# EAGLE schematic Centerboard - Prototype 2_WIP (EAGLE 7.2.0)
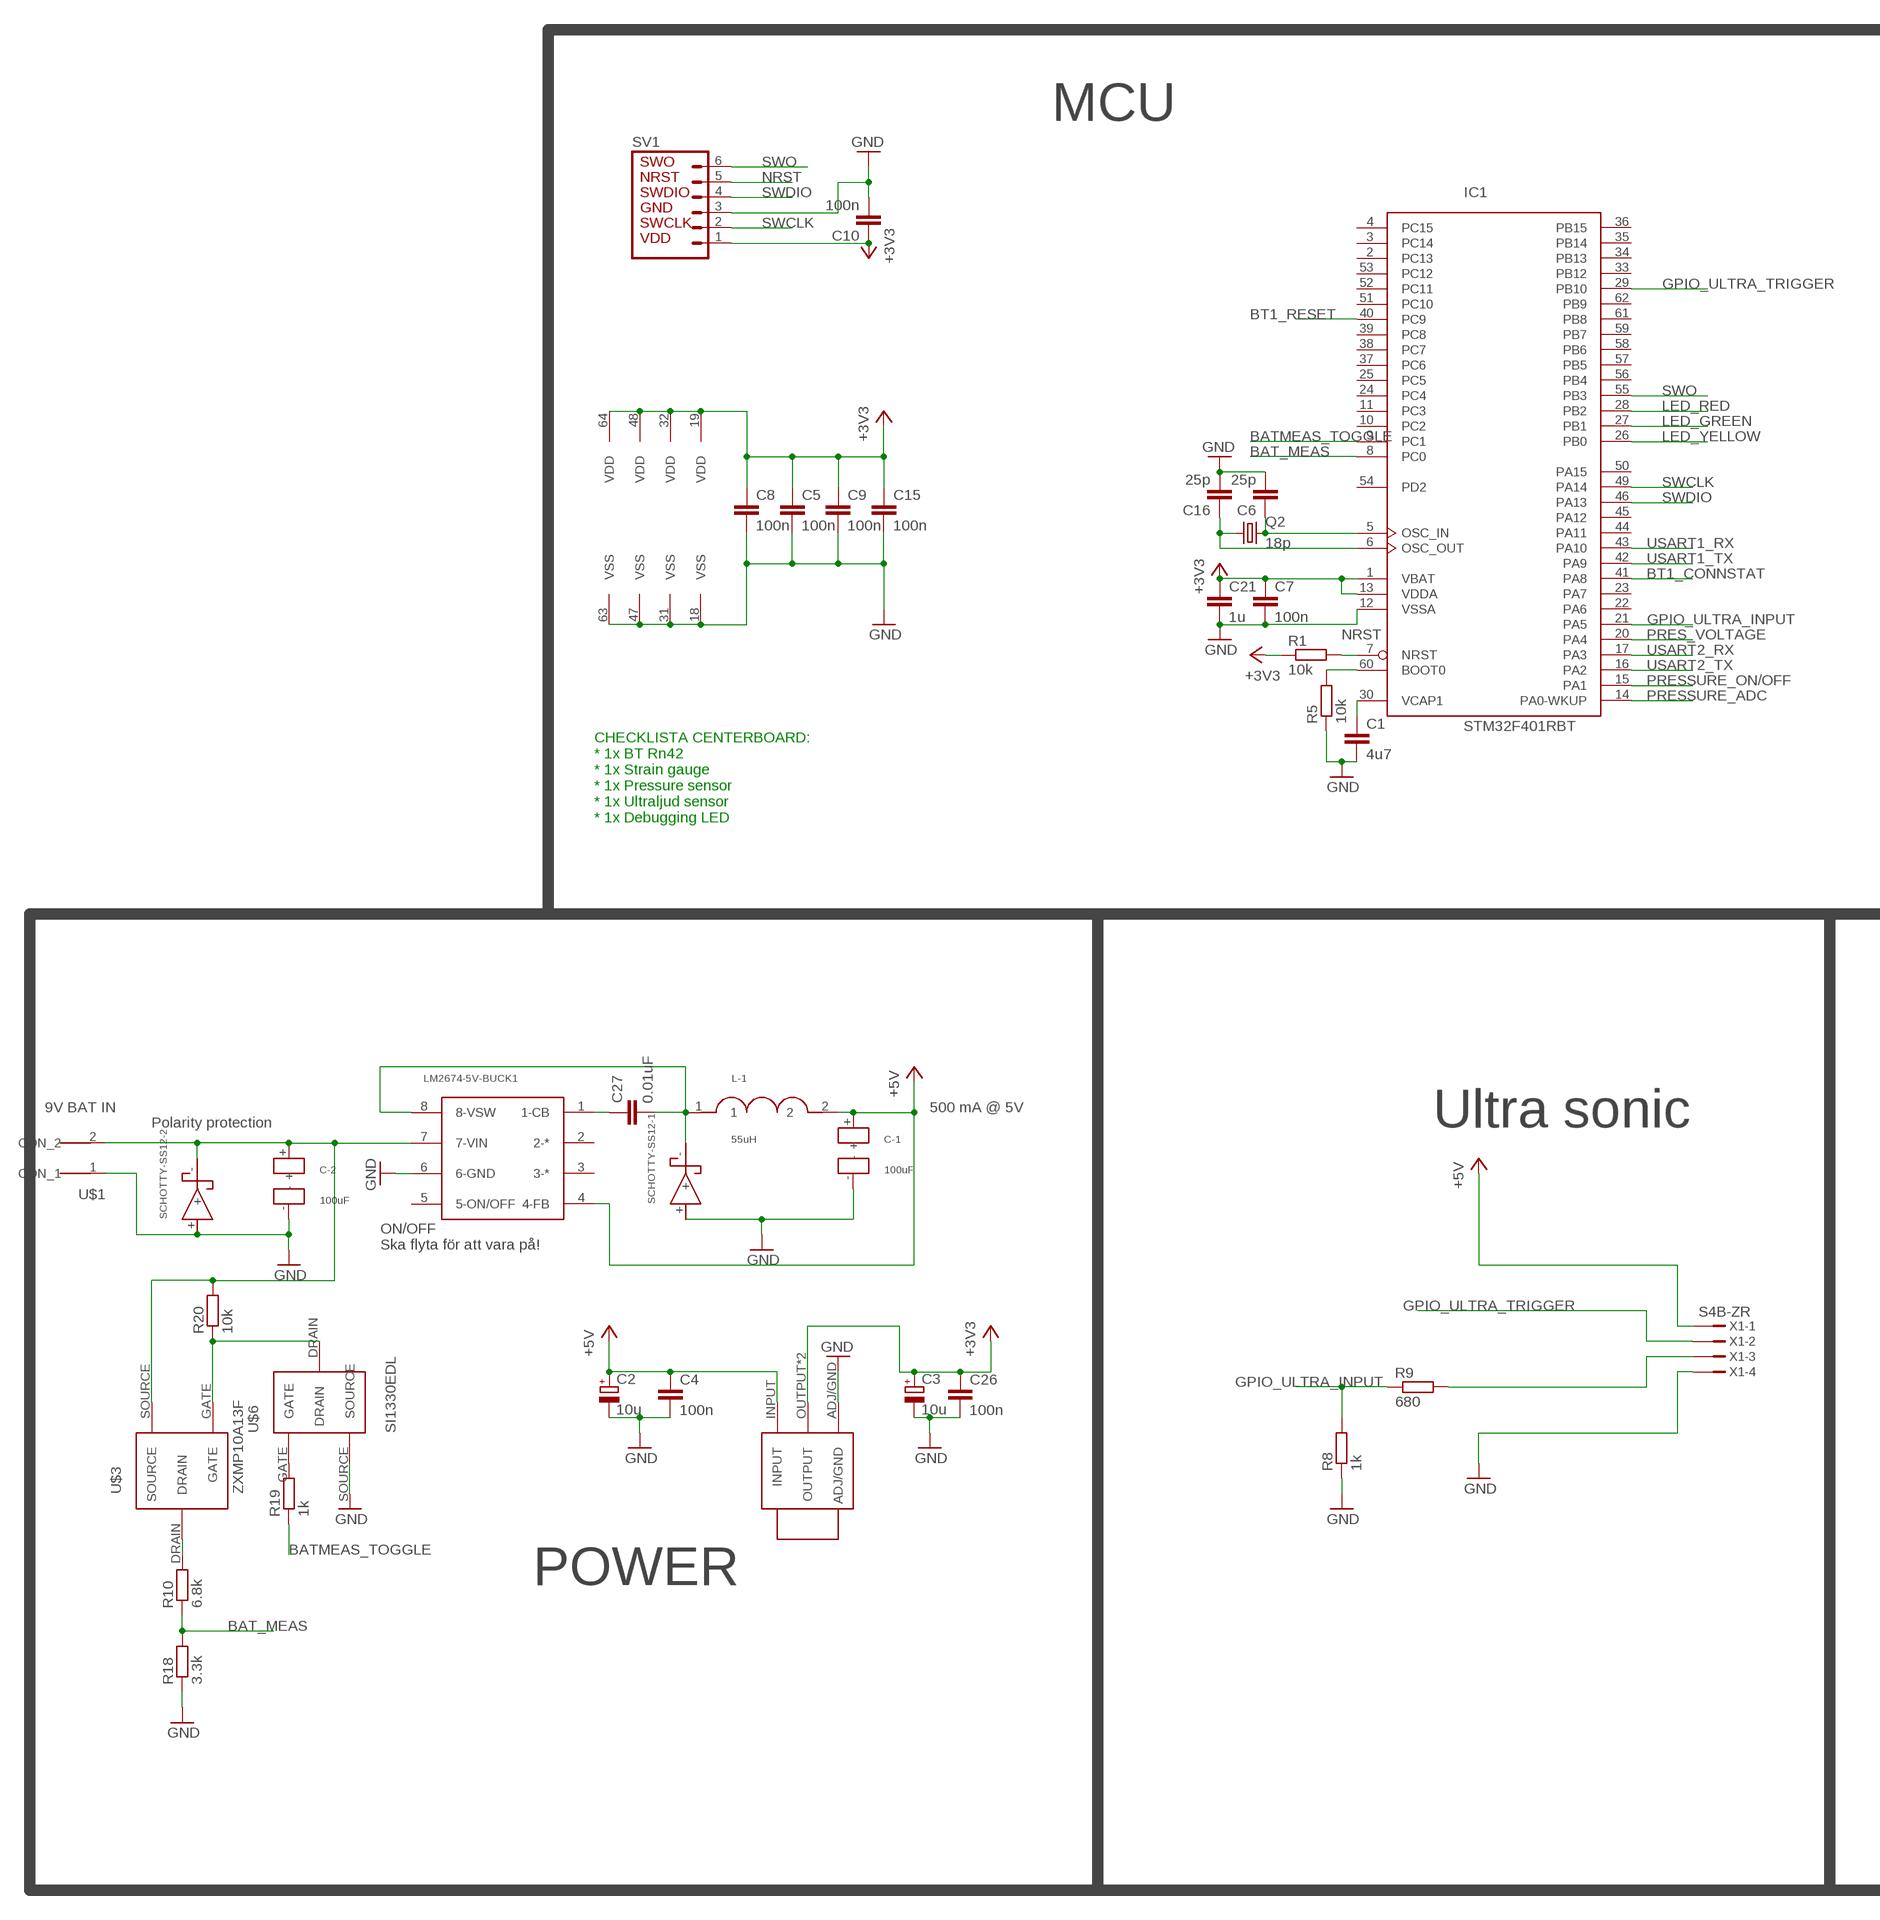
[diagram p0: schematic, sheet 1, part 1 of 2]
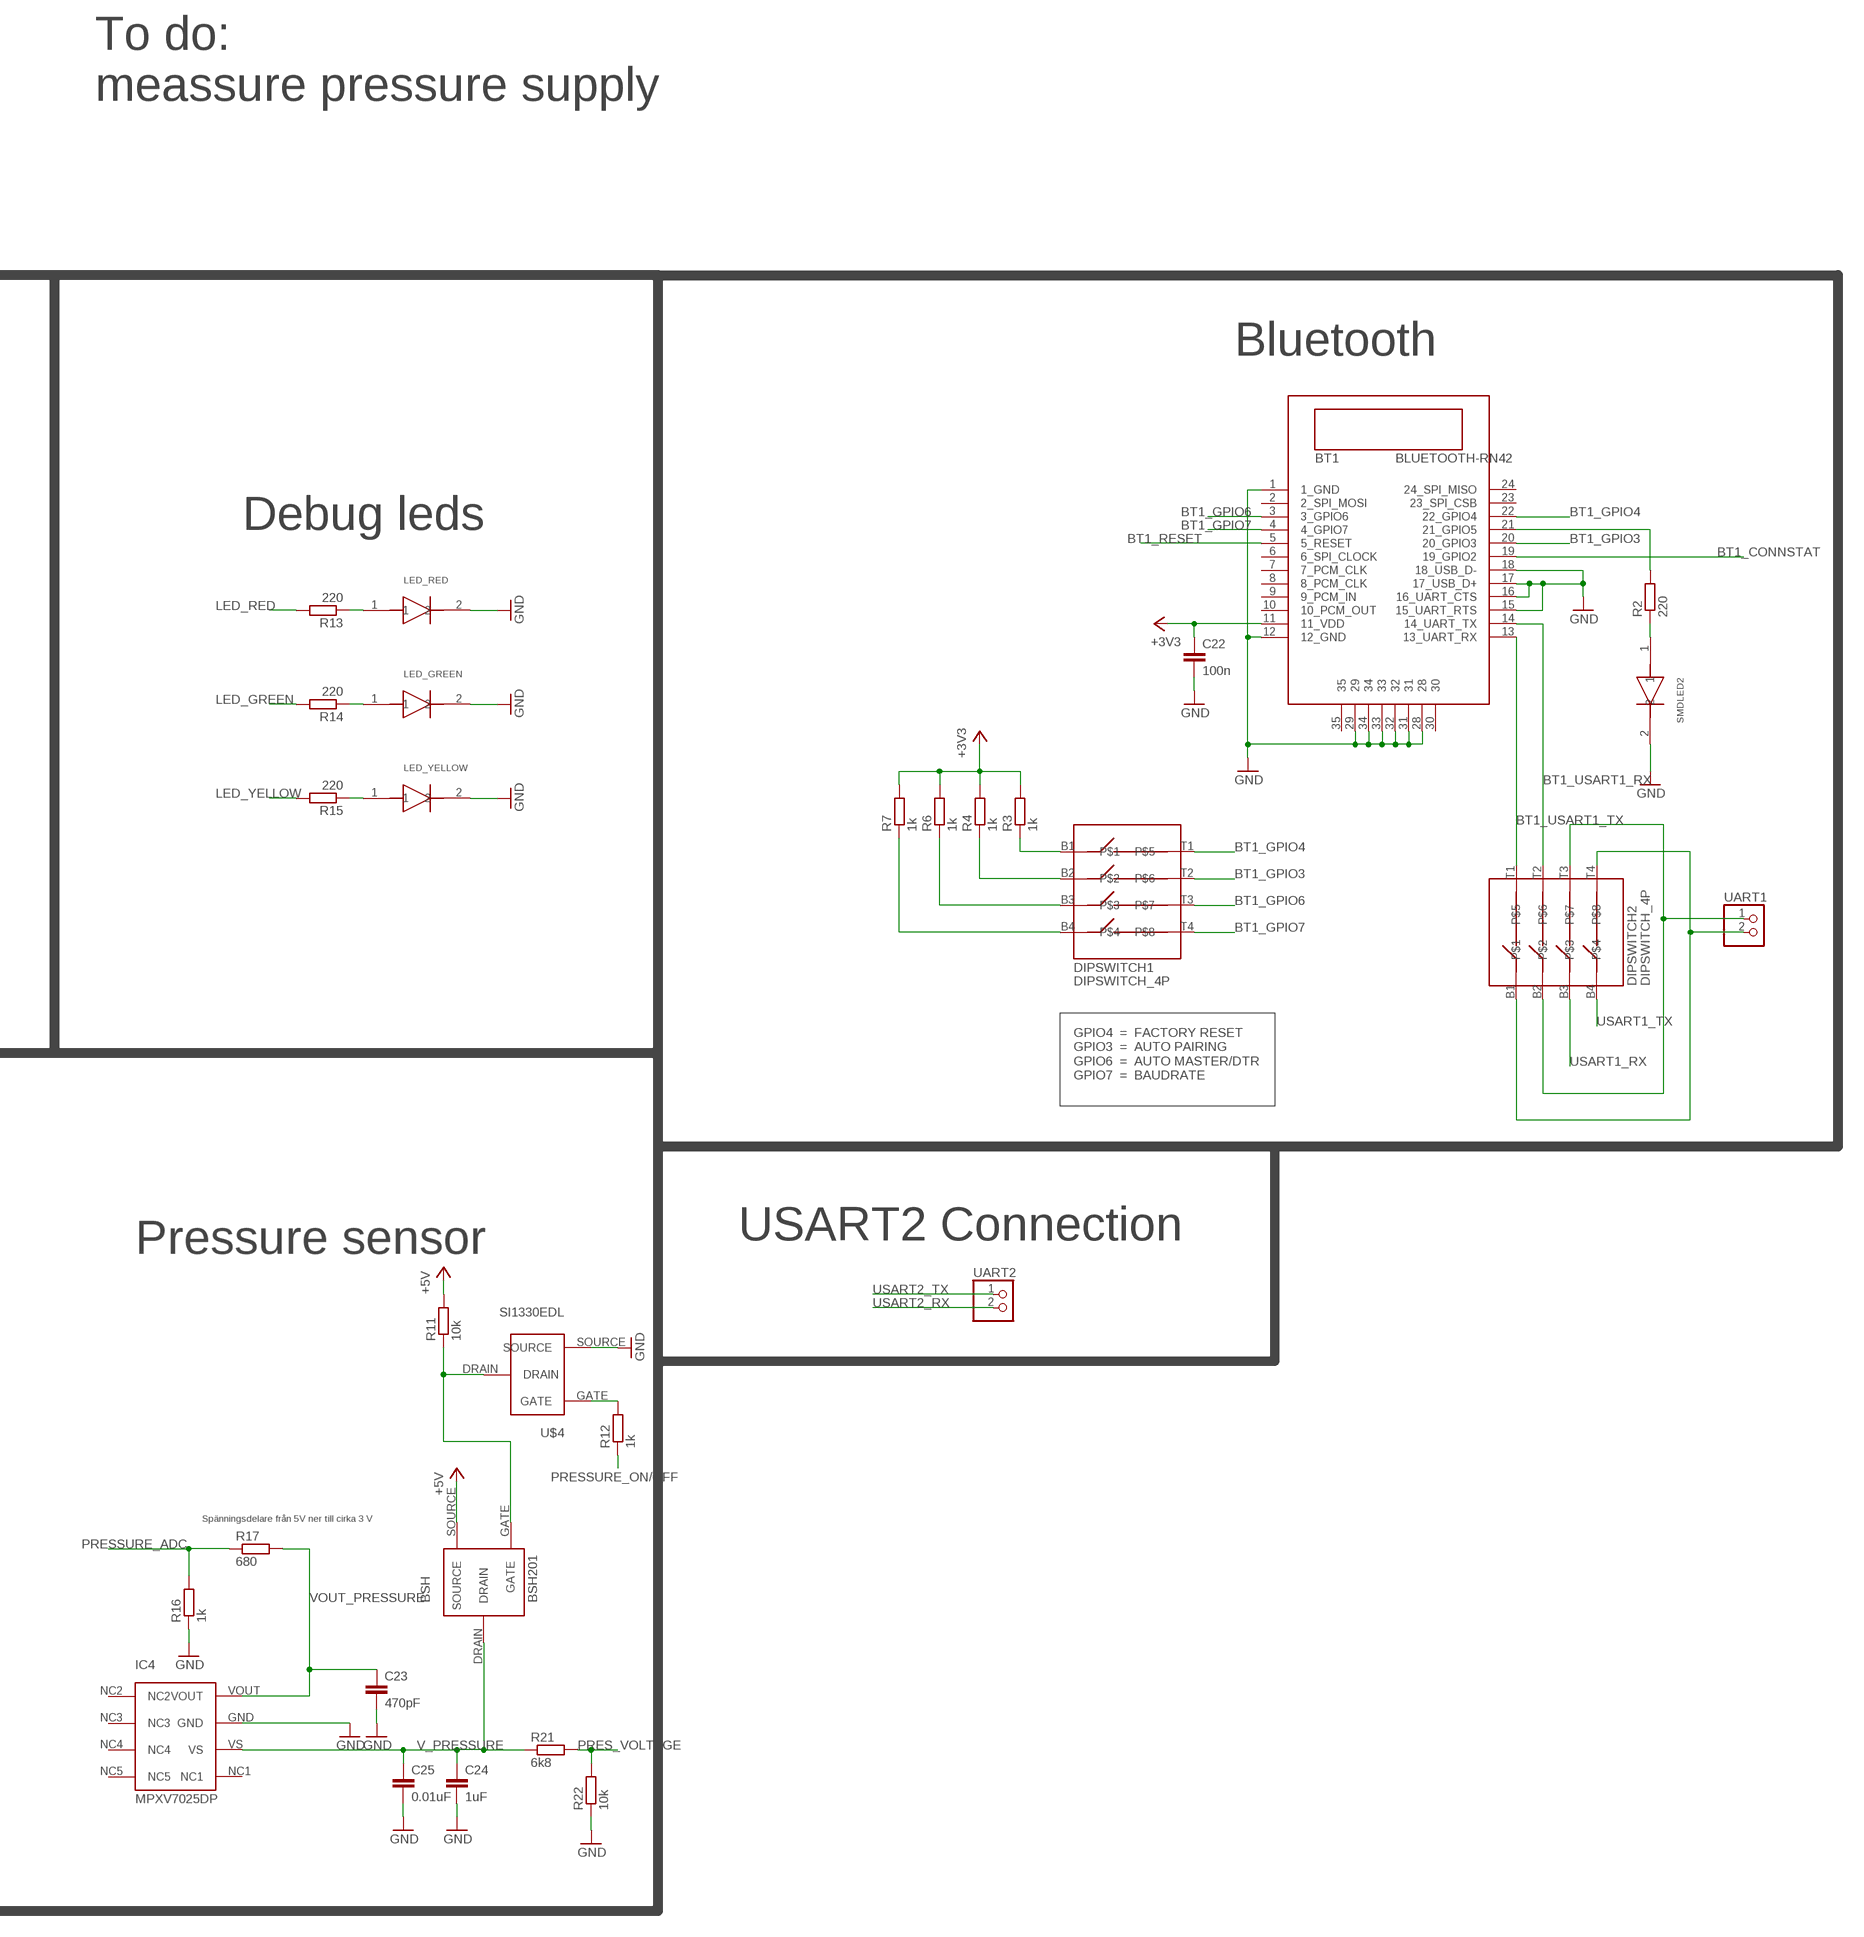
[diagram p1: schematic, sheet 1, part 2 of 2]

## Parts
BSH  BSH201  [P-CHANNEL]
BT1  BLUETOOTH-RN42  [RN42]
C1  4u7  C-EUC0805  [C0805]
C2  10u  CPOL-EU153CLV-0505  [153CLV-0505]
C3  10u  CPOL-EU153CLV-0505  [153CLV-0505]
C4  100n  C-EUC0805  [C0805]
C5  100n  C-EUC0805  [C0805]
C6  25p  C-EUC0805  [C0805]
C7  100n  C-EUC0805  [C0805]
C8  100n  C-EUC0805  [C0805]
C9  100n  C-EUC0805  [C0805]
C10  100n  C-EUC0805  [C0805]
C15  100n  C-EUC0805  [C0805]
C16  25p  C-EUC0805  [C0805]
C21  1u  C-EUC0805  [C0805]
C22  100n  C-EUC0805  [C0805]
C23  470pF  C-EUC0805  [C0805]
C24  1uF  C-EUC0805  [C0805]
C25  0.01uF  C-EUC0805  [C0805]
C26  100n  C-EUC0805  [C0805]
C27  0.01uF  C-EUC0805  [C0805]
C-1  100uF  PANASONIC-CAP  [CAP-6.3MM-DIA]
C-2  100uF  PANASONIC-CAP  [CAP-6.3MM-DIA]
DIPSWITCH1  DIPSWITCH_4P  [DIPSWITCH4P]
DIPSWITCH2  DIPSWITCH_4P  [DIPSWITCH4P]
IC1  STM32F401RBT  [LQFP64]
IC4  MPXV7025DP  [CASE1351-01]
L-1  55uH  55UH-INDUKTOR  [INDUCTOR]
LED_GREEN  SMD_LED  [SMD_LED_CUSTOM]
LED_RED  SMD_LED  [SMD_LED_CUSTOM]
LED_YELLOW  SMD_LED  [SMD_LED_CUSTOM]
LM1117-1  LM1117  [LM1117]
LM2674-5V-BUCK1  LM2674-5VBUCK  [LM2674]
Q2  18p  CRYSTALHC49UP  [HC49UP]
R1  10k  R-EU_R0805  [R0805]
R2  220  R-EU_R0805  [R0805]
R3  1k  R-EU_R0805  [R0805]
R4  1k  R-EU_R0805  [R0805]
R5  10k  R-EU_R0805  [R0805]
R6  1k  R-EU_R0805  [R0805]
R7  1k  R-EU_R0805  [R0805]
R8  1k  R-EU_R0805  [R0805]
R9  680  R-EU_R0805  [R0805]
R10  6.8k  R-EU_R0805  [R0805]
R11  10k  R-EU_R0805  [R0805]
R12  1k  R-EU_R0805  [R0805]
R13  220  R-EU_R0805  [R0805]
R14  220  R-EU_R0805  [R0805]
R15  220  R-EU_R0805  [R0805]
R16  1k  R-EU_R0805  [R0805]
R17  680  R-EU_R0805  [R0805]
R18  3.3k  R-EU_R0805  [R0805]
R19  1k  R-EU_R0805  [R0805]
R20  10k  R-EU_R0805  [R0805]
R21  6k8  R-EU_R0805  [R0805]
R22  10k  R-EU_R0805  [R0805]
SCHOTTY-SS12-1  SCHOTTY-SS12  [SCHOTTY]
SCHOTTY-SS12-2  SCHOTTY-SS12  [SCHOTTY]
SMDLED2  SMD_LED  [SMD_LED_CUSTOM]
SV1  MA06-1  [MA06-1]
U$1  JST-2WAYS  [JST-2WAYS]
U$3  ZXMP10A13F  [P-CHANNEL]
U$4  SI1330EDL  [SOT-323]
U$6  SI1330EDL  [SOT-323]
UART1  PINHD-1X2  [1X02]
UART2  PINHD-1X2  [1X02]
X1  S4B-ZR  [S4B-ZR]

## Nets
+3V3: BT1.11(11_VDD) C3.+ C5.1 C7.1 C8.1 C9.1 C10.1 C15.1 C21.1 C22.1 C26.1 IC1.1(VBAT) IC1.13(VDDA) IC1.19(VDD) IC1.32(VDD) IC1.48(VDD) IC1.64(VDD) LM1117-1.OUTPUT LM1117-1.OUTPUT2(OUTPUT) R1.1 R3.2 R4.2 R6.2 R7.2 SV1.1
+5V: BSH.SOURCE C2.+ C4.1 C-1.+ L-1.2 LM1117-1.INPUT LM2674-5V-BUCK1.4(4-FB) R11.2 X1.1
BAT_MEAS: IC1.8(PC0) R10.1 R18.2
BATMEAS_TOGGLE: IC1.9(PC1) R19.1
BATSUP: C-2.+ LM2674-5V-BUCK1.7(7-VIN) R20.2 SCHOTTY-SS12-2.- U$1.2(CON_2) U$3.SOURCE
BT1_CONNSTAT: BT1.19(19_GPIO2) IC1.41(PA8)
BT1_GPIO3: BT1.20(20_GPIO3) DIPSWITCH1.T2
BT1_GPIO4: BT1.22(22_GPIO4) DIPSWITCH1.T1
BT1_GPIO6: BT1.3(3_GPIO6) DIPSWITCH1.T3
BT1_GPIO7: BT1.4(4_GPIO7) DIPSWITCH1.T4
BT1_RESET: BT1.5(5_RESET) IC1.40(PC9)
BT1_USART1_RX: BT1.14(14_UART_TX) DIPSWITCH2.T2
BT1_USART1_TX: BT1.13(13_UART_RX) DIPSWITCH2.T1
GND: BT1.1(1_GND) BT1.12(12_GND) BT1.15(15_UART_RTS) BT1.16(16_UART_CTS) BT1.17(17_USB_D+) BT1.18(18_USB_D-) BT1.28 BT1.29 BT1.31 BT1.32 BT1.33 BT1.34 C1.2 C2.- C3.- C4.2 C5.2 C6.2 C7.2 C8.2 C9.2 C10.2 C15.2 C16.2 C21.2 C22.2 C23.2 C24.2 C25.2 C26.2 C-1.- C-2.- IC1.12(VSSA) IC1.18(VSS) IC1.31(VSS) IC1.47(VSS) IC1.63(VSS) IC4.GND LED_GREEN.2 LED_RED.2 LED_YELLOW.2 LM1117-1.ADJ/GND LM2674-5V-BUCK1.6(6-GND) R5.1 R8.1 R16.1 R18.1 R22.1 SCHOTTY-SS12-1.+ SCHOTTY-SS12-2.+ SMDLED2.2 SV1.3 U$1.1(CON_1) U$4.SOURCE U$6.SOURCE X1.4
GPIO_ULTRA_INPUT: IC1.21(PA5) R8.2 R9.1
GPIO_ULTRA_TRIGGER: IC1.29(PB10) X1.2
LED_GREEN: IC1.27(PB1) R14.2
LED_RED: IC1.28(PB2) R13.2
LED_YELLOW: IC1.26(PB0) R15.2
N$1: C1.1 IC1.30(VCAP1)
N$2: IC1.60(BOOT0) R5.2
N$3: LED_RED.1 R13.1
N$4: BT1.21(21_GPIO5) R2.2
N$5: DIPSWITCH1.B1 R3.1
N$6: DIPSWITCH1.B2 R4.1
N$7: DIPSWITCH1.B3 R6.1
N$8: C6.1 IC1.5(OSC_IN) Q2.2
N$9: C16.1 IC1.6(OSC_OUT) Q2.1
N$10: DIPSWITCH1.B4 R7.1
N$11: R2.1 SMDLED2.1
N$12: R9.2 X1.3
N$13: C27.1 LM2674-5V-BUCK1.1(1-CB)
N$14: BSH.GATE R11.1 U$4.DRAIN
N$15: R12.2 U$4.GATE
N$16: LED_GREEN.1 R14.1
N$17: LED_YELLOW.1 R15.1
N$18: R10.2 U$3.DRAIN
N$19: R19.2 U$6.GATE
N$20: R20.1 U$3.GATE U$6.DRAIN
N$21: DIPSWITCH2.B2 DIPSWITCH2.T3 UART1.1
N$22: DIPSWITCH2.B1 DIPSWITCH2.T4 UART1.2
NRST: IC1.7(NRST) R1.2 SV1.5
PRES_VOLTAGE: IC1.20(PA4) R21.2 R22.2
PRESSURE_ADC: IC1.14(PA0-WKUP) R16.2 R17.1
PRESSURE_ON/OFF: IC1.15(PA1) R12.1
SWCLK: IC1.49(PA14) SV1.2
SWDIO: IC1.46(PA13) SV1.4
SWO: IC1.55(PB3) SV1.6
USART1_RX: DIPSWITCH2.B3 IC1.43(PA10)
USART1_TX: DIPSWITCH2.B4 IC1.42(PA9)
USART2_RX: IC1.17(PA3) UART2.2
USART2_TX: IC1.16(PA2) UART2.1
V_PRESSURE: BSH.DRAIN C24.1 C25.1 IC4.VS R21.1
VOUT: C27.2 L-1.1 LM2674-5V-BUCK1.8(8-VSW) SCHOTTY-SS12-1.-
VOUT_PRESSURE: C23.1 IC4.VOUT R17.2
Unconnected: BT1.2(2_SPI_MOSI) BT1.6(6_SPI_CLOCK) BT1.7(7_PCM_CLK) BT1.8(8_PCM_CLK) BT1.9(9_PCM_IN) BT1.10(10_PCM_OUT) BT1.23(23_SPI_CSB) BT1.24(24_SPI_MISO) BT1.30 BT1.35 IC1.2(PC13) IC1.3(PC14) IC1.4(PC15) IC1.10(PC2) IC1.11(PC3) IC1.22(PA6) IC1.23(PA7) IC1.24(PC4) IC1.25(PC5) IC1.33(PB12) IC1.34(PB13) IC1.35(PB14) IC1.36(PB15) IC1.37(PC6) IC1.38(PC7) IC1.39(PC8) IC1.44(PA11) IC1.45(PA12) IC1.50(PA15) IC1.51(PC10) IC1.52(PC11) IC1.53(PC12) IC1.54(PD2) IC1.56(PB4) IC1.57(PB5) IC1.58(PB6) IC1.59(PB7) IC1.61(PB8) IC1.62(PB9) IC4.NC1 IC4.NC2 IC4.NC3 IC4.NC4 IC4.NC5 LM2674-5V-BUCK1.2(2-*) LM2674-5V-BUCK1.3(3-*) LM2674-5V-BUCK1.5(5-ON/OFF)

## Notes on the sheet
- To do:
  meassure pressure supply
- MCU | Bluetooth
- Debug leds
- CHECKLISTA CENTERBOARD:
  * 1x BT Rn42
  * 1x Strain gauge
  * 1x Pressure sensor
  * 1x Ultraljud sensor
  * 1x Debugging LED
- GPIO4  =  FACTORY RESET
  GPIO3  =  AUTO PAIRING
  GPIO6  =  AUTO MASTER/DTR
  GPIO7  =  BAUDRATE
- 9V BAT IN | 500 mA @ 5V
- Polarity protection | Ultra sonic | USART2 Connection
- Pressure sensor
- ON/OFF
  Ska flyta för att vara på!
- Spänningsdelare från 5V ner till cirka 3 V
- POWER

## Library data of the parts
BSH = BSH201:BSH201
BT1 = RN42:BLUETOOTH-RN42
C1 C4-C10 C15 C16 C21-C27 = rcl:C-EU: CAPACITOR, European symbol
C2 C3 = rcl:CPOL-EU: POLARIZED CAPACITOR, European symbol
C-1 C-2 = panasonic-cap-100u:PANASONIC-CAP
DIPSWITCH1 DIPSWITCH2 = dipswitch4p_updated:DIPSWITCH_4P
IC1 = E7020E:STM32F401R*T: ARM 32-bit Cortex™-M3 CPU 84 MHz maximum frequency 128 to 256 Kbytes of Flash memory 64 kbytes of SRAM 50 GPIOs 1.7 to 3.6 V application supply
IC4 = MPXV7025:MPXV7025DP
L-1 = inductor-55u:55UH-INDUKTOR
LED_GREEN LED_RED LED_YELLOW SMDLED2 = greenled_smd:SMD_LED
LM1117-1 = LM1117-3v3_vreg:LM1117
LM2674-5V-BUCK1 = LM2674-5v-buck:LM2674-5VBUCK
Q2 = crystal:CRYSTAL: CRYSTAL; OC_FARNELL: unknown; OC_NEWARK: unknown
R1 R5 R8-R12 R16-R22 = rcl:R-EU_: RESISTOR, European symbol
R2-R4 R6 R7 R13-R15 = resistor:R-EU_: RESISTOR, European symbol
SCHOTTY-SS12-1 SCHOTTY-SS12-2 = schotty-SS12:SCHOTTY-SS12
SV1 = E7020E:MA06-1: PIN HEADER; OC_FARNELL: unknown; OC_NEWARK: unknown
U$1 = jst-2ways-zh:JST-2WAYS
U$3 = ZXMP10A13F:ZXMP10A13F
U$4 U$6 = SI1330EDL:SI1330EDL
UART1 UART2 = pinhead:PINHD-1X2: PIN HEADER
X1 = con-jst:?4B-ZR: ZH CONNECTOR 1.5 mm, 4 pin 1 row Source: http://www.jst.com .. eZH.pdf; MF: FARNELL; MPN: S4B-ZR(LF)(SN); OC_FARNELL: 9491830; OC_NEWARK: 38K8076